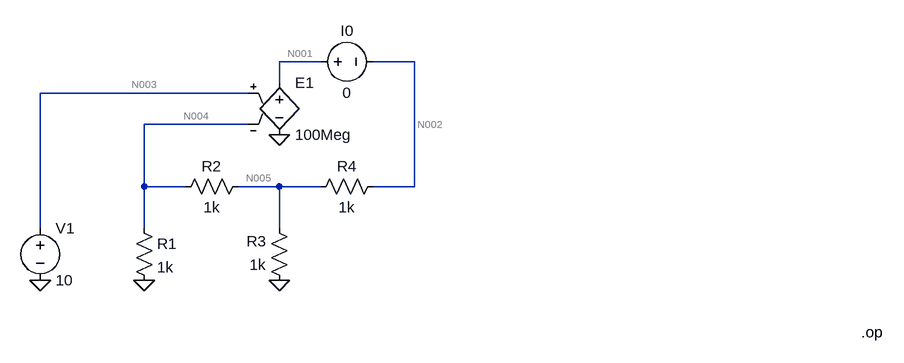
[diagram p0: schematic HW05P04.asc]
HW05P04.asc, the LTspice schematic file:
Version 4
SHEET 1 1368 680
WIRE 496 -144 432 -144
WIRE 640 -144 576 -144
WIRE 432 -112 432 -144
WIRE 384 -96 64 -96
WIRE 384 -48 224 -48
WIRE 224 48 224 -48
WIRE 288 48 224 48
WIRE 432 48 368 48
WIRE 496 48 432 48
WIRE 640 48 640 -144
WIRE 640 48 576 48
WIRE 64 112 64 -96
WIRE 224 112 224 48
WIRE 432 112 432 48
FLAG 432 -32 0
FLAG 432 192 0
FLAG 224 192 0
FLAG 64 192 0
DATAFLAG 640 -144 ""
SYMBOL voltage 64 96 R0
SYMATTR InstName V1
SYMATTR Value 10
SYMBOL res 208 96 R0
SYMATTR InstName R1
SYMATTR Value 1k
SYMBOL res 384 32 R90
WINDOW 0 0 56 VBottom 2
WINDOW 3 32 56 VTop 2
SYMATTR InstName R2
SYMATTR Value 1k
SYMBOL res 448 208 R180
WINDOW 0 36 76 Left 2
WINDOW 3 36 40 Left 2
SYMATTR InstName R3
SYMATTR Value 1k
SYMBOL res 480 64 R270
WINDOW 0 32 56 VTop 2
WINDOW 3 0 56 VBottom 2
SYMATTR InstName R4
SYMATTR Value 1k
SYMBOL e 432 -128 R0
SYMATTR InstName E1
SYMATTR Value 100Meg
SYMBOL voltage 480 -144 R270
WINDOW 0 32 56 VTop 2
WINDOW 3 -32 56 VBottom 2
SYMATTR InstName I0
SYMATTR Value 0
TEXT 1328 272 Left 2 !.op

The netlist it stands for:
* HW05P04.asc
V1 N003 0 10
R1 N004 0 1k
R2 N005 N004 1k
R3 0 N005 1k
R4 N005 N002 1k
E1 N001 0 N003 N004 100Meg
V§I0 N001 N002 0
.op
.backanno
.end

* Results of the author's LTspice run, read from the files saved beside the schematic
* Operating Point:
*   V(n003) = 10 V
*   V(n004) = 10 V
*   V(n005) = 20 V
*   V(n002) = 50 V
*   V(n001) = 50 V
*   I(R1) = 10 mA
*   I(R2) = 10 mA
*   I(R3) = -20 mA
*   I(R4) = -30 mA
*   I(E1) = -30 mA
*   I(V1) = 0 A
*   I(I0) = 30 mA